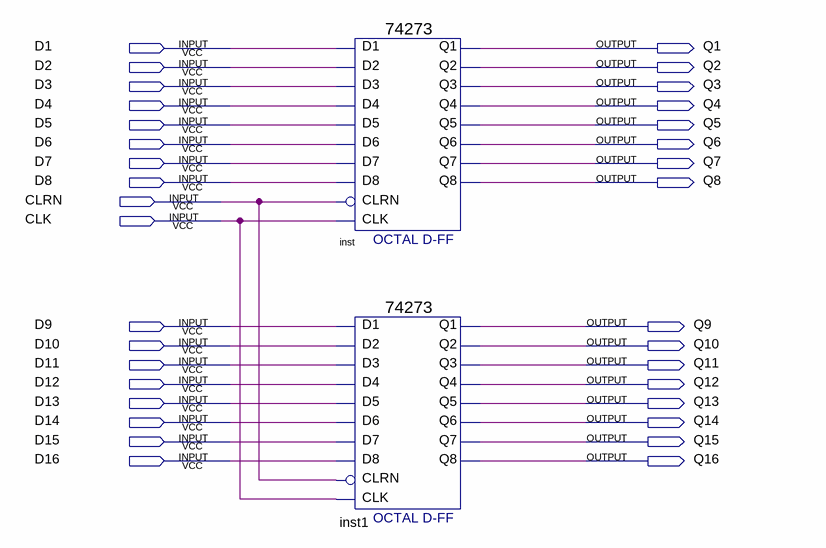
[diagram p0: schematic sheet]
// Quartus schematic register.bdf as structural Verilog: 2 symbols, 34 pins
module register (
  input  D1,
  input  D2,
  input  D3,
  input  D4,
  input  D5,
  input  D6,
  input  D7,
  input  D8,
  input  CLRN,
  input  CLK,
  input  D9,
  input  D10,
  input  D11,
  input  D12,
  input  D13,
  input  D14,
  input  D15,
  input  D16,
  output Q1,
  output Q2,
  output Q3,
  output Q4,
  output Q5,
  output Q6,
  output Q7,
  output Q8,
  output Q9,
  output Q10,
  output Q11,
  output Q12,
  output Q13,
  output Q14,
  output Q15,
  output Q16
);

  \74273  inst (
    .D2(D2), .D3(D3), .D1(D1), .D4(D4), .D7(D7), .D6(D6), .D5(D5), .D8(D8), .CLK(CLK), .CLRN(CLRN), .Q4(Q4),
    .Q1(Q1), .Q2(Q2), .Q3(Q3), .Q6(Q6), .Q5(Q5), .Q7(Q7), .Q8(Q8));
  \74273  inst1 (
    .D2(D10), .D3(D11), .D1(D9), .D4(D12), .D7(D15), .D6(D14), .D5(D13), .D8(D16), .CLK(CLK), .CLRN(CLRN),
    .Q4(Q12), .Q1(Q9), .Q2(Q10), .Q3(Q11), .Q6(Q14), .Q5(Q13), .Q7(Q15), .Q8(Q16));
endmodule
